# EAGLE design Rev1.1 (EAGLE 9.0.1)
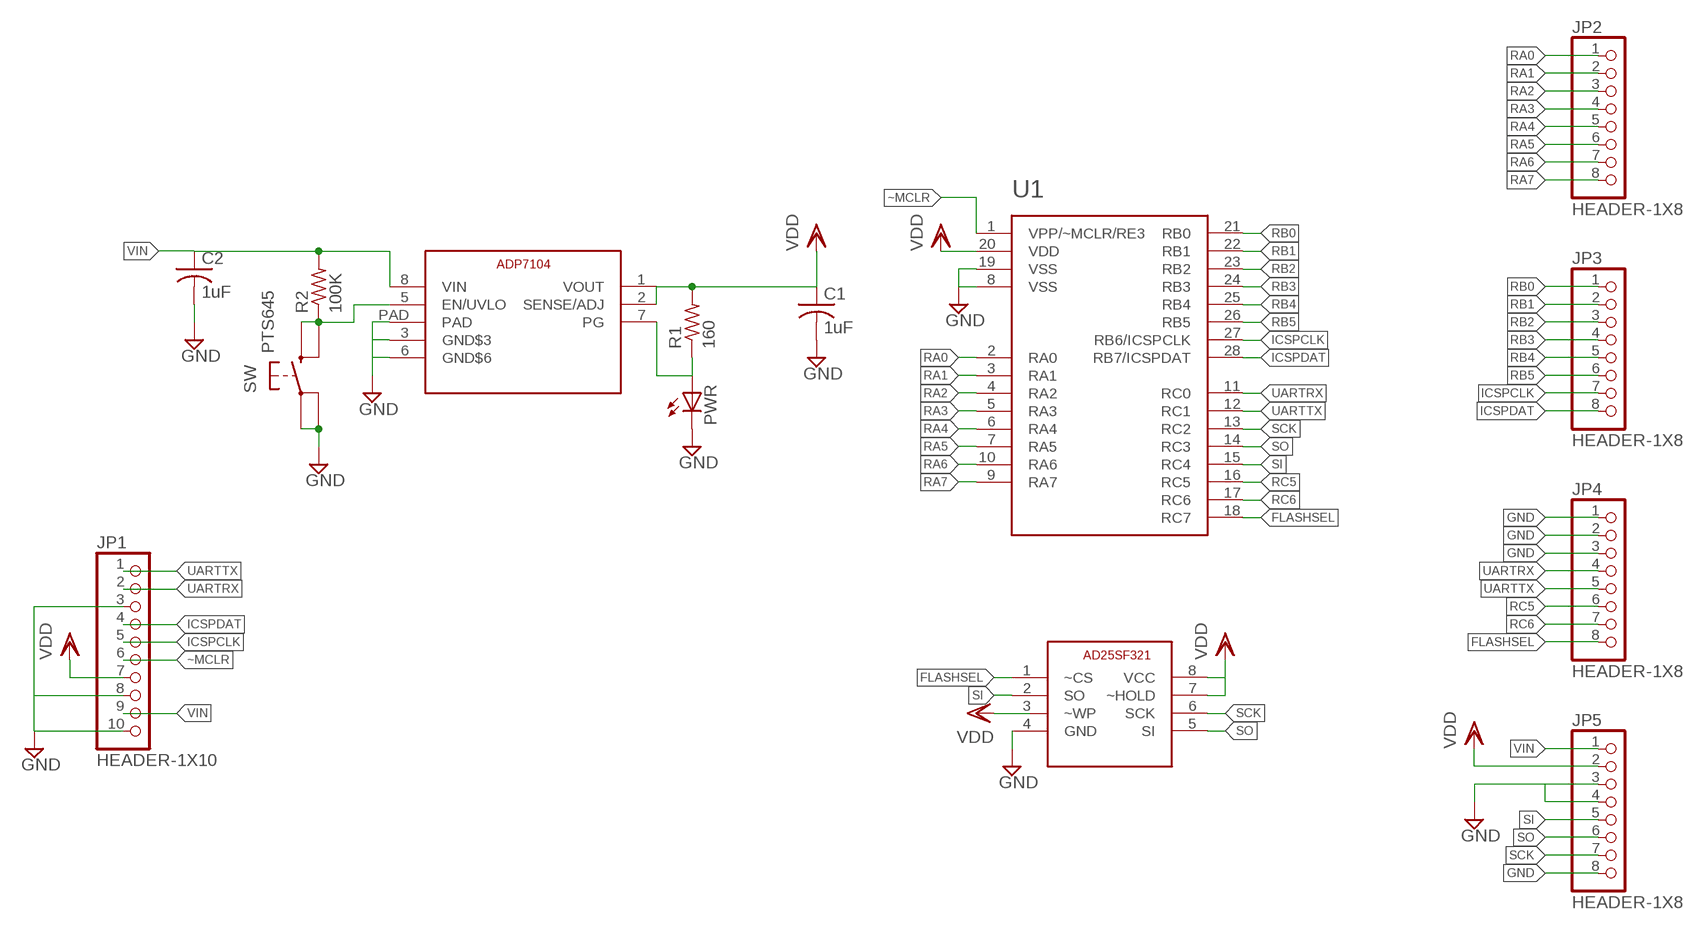
[diagram p0: schematic, sheet 1]

## Parts
C1  1uF  C-USC0805  [C0805]
C2  1uF  C-USC0805  [C0805]
JP1  HEADER-1X10  [1X10]
JP2  HEADER-1X8  [1X08]
JP3  HEADER-1X8  [1X08]
JP4  HEADER-1X8  [1X08]
JP5  HEADER-1X8  [1X08]
PWR  LEDCHIP-LED0805  [CHIP-LED0805]
R1  160  R-US_R0805  [R0805]
R2  100K  R-US_R0805  [R0805]
SW  PTS645  [TSWITCH-6MM]
U1  PIC16F1778  [SO28W]
U2  AT25SF321  [SOIC8]
U3  ADP7104  [SOIC8-EXP-PAD]

## Nets
FLASHSEL: JP4.8 U1.18(RC7) U2.1(~CS)
GND: C1.2 C2.2 JP1.3 JP1.8 JP1.10 JP4.1 JP4.2 JP4.3 JP5.3 JP5.4 JP5.8 PWR.C SW.P$1 SW.P$2 U1.8(VSS) U1.19(VSS) U2.4(GND) U3.3(GND$3) U3.6(GND$6) U3.PAD
ICSPCLK: JP1.5 JP3.7 U1.27(RB6/ICSPCLK)
ICSPDAT: JP1.4 JP3.8 U1.28(RB7/ICSPDAT)
N$11: PWR.A R1.1 U3.7(PG)
N$12: R2.1 SW.P$3 SW.P$4 U3.5(EN/UVLO)
RA0: JP2.1 U1.2(RA0)
RA1: JP2.2 U1.3(RA1)
RA2: JP2.3 U1.4(RA2)
RA3: JP2.4 U1.5(RA3)
RA4: JP2.5 U1.6(RA4)
RA5: JP2.6 U1.7(RA5)
RA6: JP2.7 U1.10(RA6)
RA7: JP2.8 U1.9(RA7)
RB0: JP3.1 U1.21(RB0)
RB1: JP3.2 U1.22(RB1)
RB2: JP3.3 U1.23(RB2)
RB3: JP3.4 U1.24(RB3)
RB4: JP3.5 U1.25(RB4)
RB5: JP3.6 U1.26(RB5)
RC5: JP4.6 U1.16(RC5)
RC6: JP4.7 U1.17(RC6)
SCK: JP5.7 U1.13(RC2) U2.6(SCK)
SI: JP5.5 U1.15(RC4) U2.2(SO)
SO: JP5.6 U1.14(RC3) U2.5(SI)
UARTRX: JP1.2 JP4.4 U1.11(RC0)
UARTTX: JP1.1 JP4.5 U1.12(RC1)
VDD: C1.1 JP1.7 JP5.2 R1.2 U1.20(VDD) U2.7(~HOLD) U2.8(VCC) U3.1(VOUT) U3.2(SENSE/ADJ)
VIN: C2.1 JP1.9 JP5.1 R2.2 U3.8(VIN)
~MCLR: JP1.6 U1.1(VPP/~MCLR/RE3)
Unconnected: U2.3(~WP)

## Library data of the parts
C1 C2 = adafruit:C-US: CAPACITOR, American symbol
JP1 = lib-works:HEADER-1X10
JP2-JP5 = lib-works:HEADER-1X8
PWR = adafruit:LED: LED OSRAM: - CHIPLED LG R971, LG N971, LY N971, LG Q971, LY Q971, LO R971, LY R971 LH N974, LH R974 LS Q976, LO Q976, LY Q976 LO Q996 - Hyper CHIPLED LW Q18S LB Q993, LB Q99A, LB R99A - SideLED LS A670, LO A670, LY A670, LG A670, LP A670 LB A673, LV A673, LT A673, LW A673 LH A674 LY A675 LS A676, LA A676, LO A676, LY A676, LW A676 LS A679, LY A679, LG A679 - Hyper Micro SIDELED® LS Y876, LA Y876, LO Y876, LY Y876 LT Y87S - SmartLED LW L88C, LW L88S LB L89C, LB L89S, LG L890 LS L89K, LO L89K, LY L89K LS L896, LA L896, LO L896, LY L896 - TOPLED LS T670, LO T670, LY T670, LG T670, LP T670 LSG T670, LSP T670, LSY T670, LOP T670, LYG T670 LG T671, LOG T671, LSG T671 LB T673, LV T673, LT T673, LW T673 LH T674 LS T676, LA T676, LO T676, LY T676, LB T676, LH T676, LSB T676, LW T676 LB T67C, LV T67C, LT T67C, LS T67K, LO T67K, LY T67K, LW E67C LS E67B, LA E67B, LO E67B, LY E67B, LB E67C, LV E67C, LT E67C LW T67C LS T679, LY T679, LG T679 LS T770, LO T770, LY T770, LG T770, LP T770 LB T773, LV T773, LT T773, LW T773 LH T774 LS E675, LA E675, LY E675, LS T675 LS T776, LA T776, LO T776, LY T776, LB T776 LHGB T686 LT T68C, LB T68C - Hyper Mini TOPLED® LB M676 - Mini TOPLED Santana® LG M470 LS M47K, LO M47K, LY M47K Source: http://www.osram.convergy.de/
R1 R2 = adafruit:R-US_: RESISTOR, American symbol
SW = lib-works:PTS645
U1 = lib-works:PIC16F1778
U2 = lib-works:AT25SF321
U3 = lib-works:ADP7104

## Board
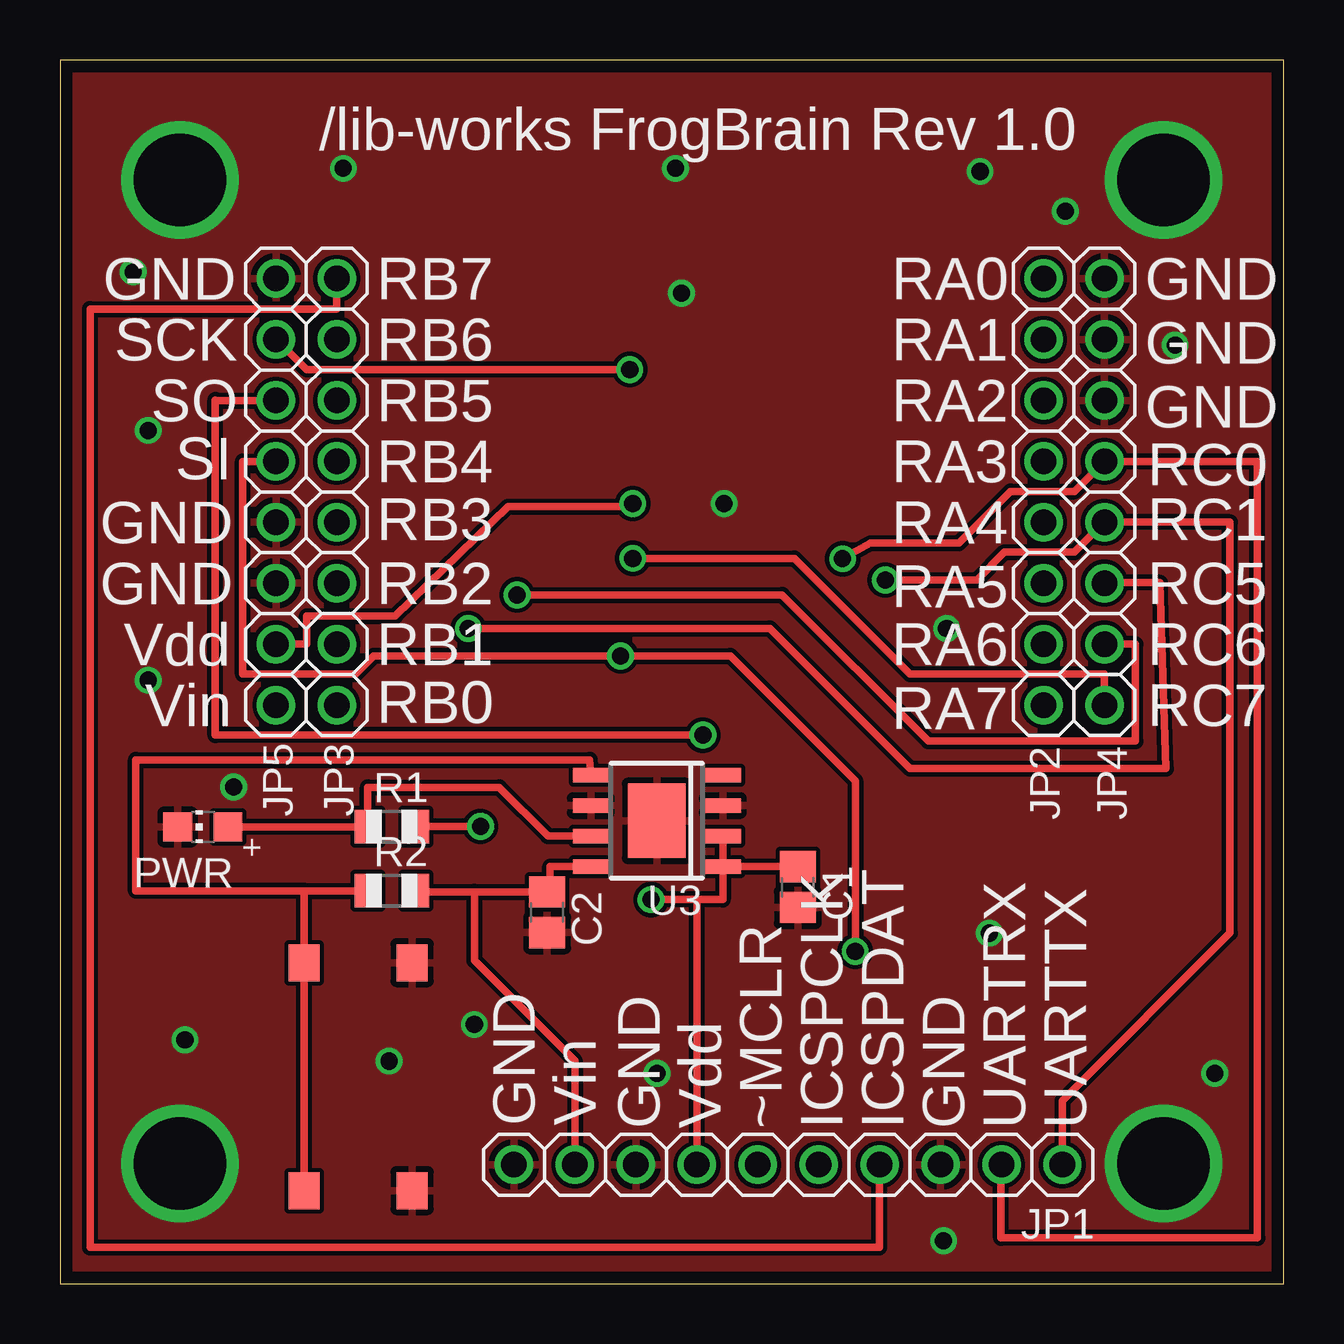
[diagram p1: board, top side]
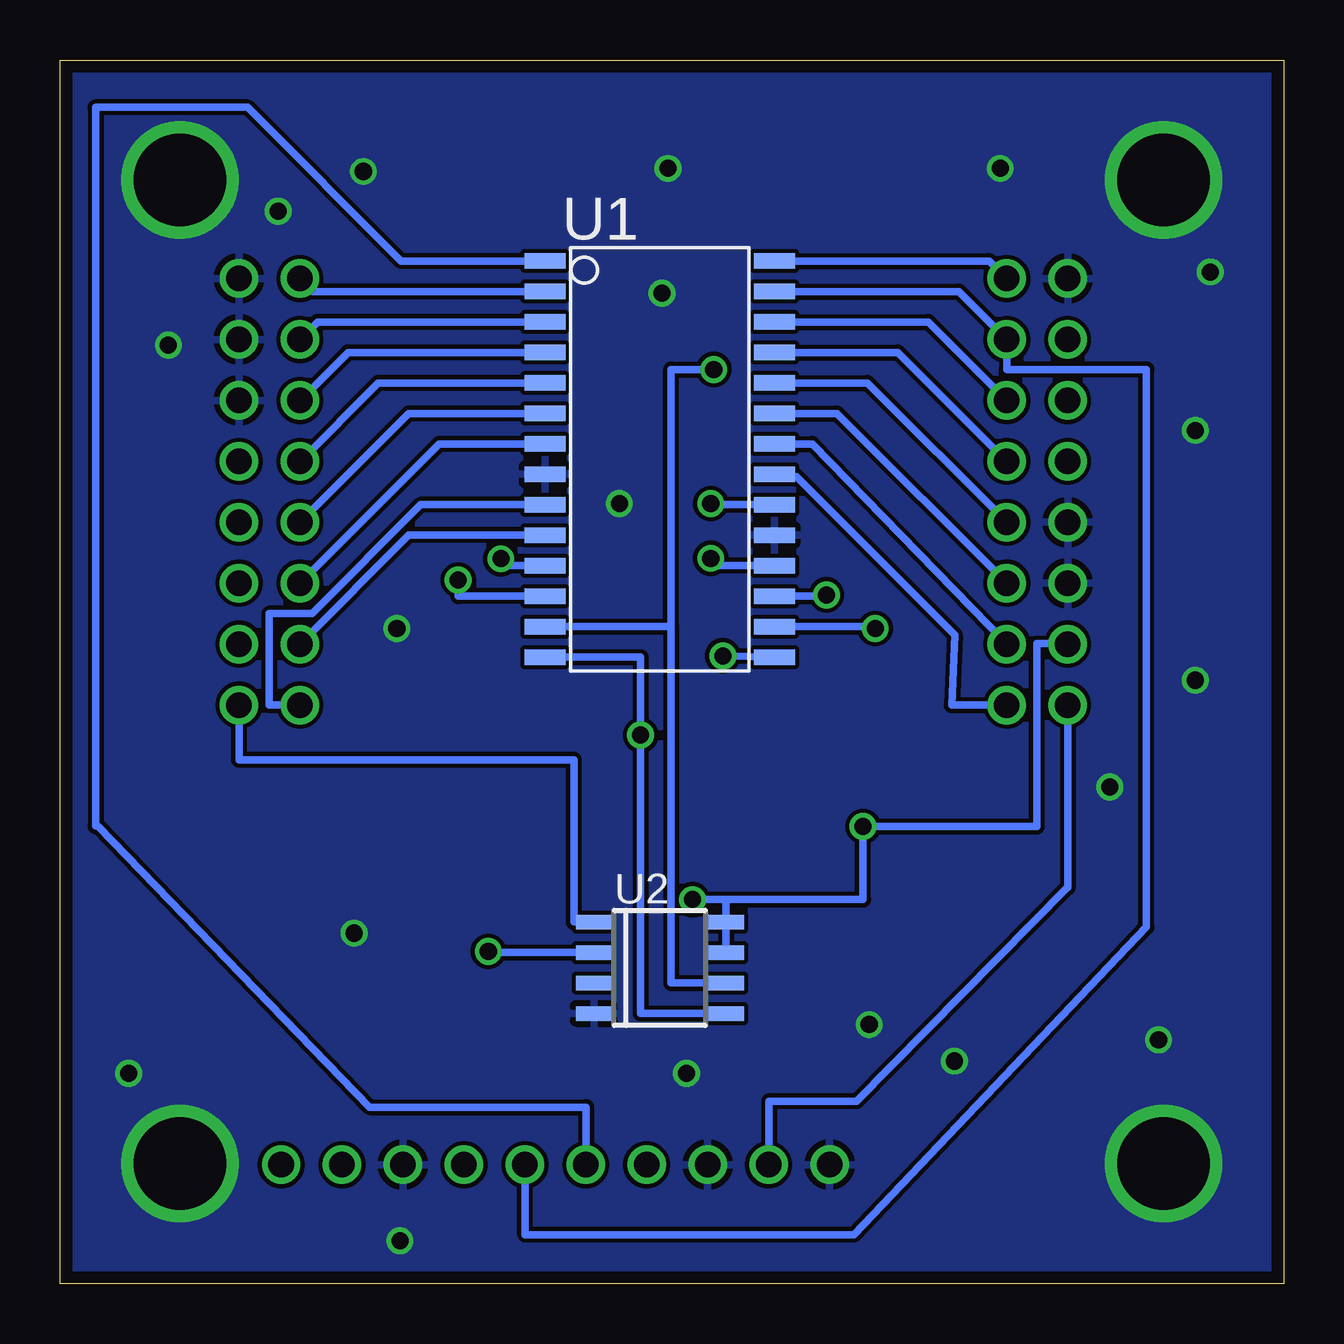
[diagram p2: board, bottom side, seen from below]

Size 51 x 51 mm. Coordinates in mm from the lower left corner, seen from the top.
Outline: 0,0 51,0 51,51 0,51 0,0
Copper layers (1*16): Top 0.035mm / dielectric 1.5mm / Bottom 0.035mm
Design rules "default *": minimum track width 7mil, minimum drill 0.50038125mm, track to track 7mil, track to pad 7mil, pad to pad 7mil, via to via 7mil, smd to smd 7mil, copper to edge 20mil, drill to drill 7mil, minimum pad ring 10mil, minimum via ring 8mil, stop-mask expansion 4mil, vias tented up to drill 0mil, thermal gap 10mil

### Footprints (pad centres in the part's own frame; a part is rotated, then mirrored left to right if it is on the bottom)
C0805 = smd 1.3 x 1.5: 1 -0.85,0; 2 0.85,0
1X10 = drill 1.067: 1 -8.89,0; 2 -6.35,0; 3 -3.81,0; 4 -1.27,0; 5 1.27,0; 6 3.81,0; 7 6.35,0; 8 8.89,0; 9 11.43,0; 10 13.97,0
1X08 = drill 1.067: 1 -8.89,0; 2 -6.35,0; 3 -3.81,0; 4 -1.27,0; 5 1.27,0; 6 3.81,0; 7 6.35,0; 8 8.89,0
CHIP-LED0805 = smd 1.2 x 1.2: A 0,-1.05; C 0,1.05
R0805 = smd 1.1 x 1.4: 1 -1,0; 2 1,0
TSWITCH-6MM = smd 1.55 x 1.3: P$1 -4.75,2.25; P$2 4.75,2.25; P$3 -4.75,-2.25; P$4 4.75,-2.25
SO28W = smd 0.65 x 1.7: 1 -7.62,-4.78; 2 -6.35,-4.78; 3 -5.08,-4.78; 4 -3.81,-4.78; 5 -2.54,-4.78; 6 -1.27,-4.78; 7 0,-4.78; 8 1.27,-4.78; 9 2.54,-4.78; 10 3.81,-4.78; 11 5.08,-4.78; 12 6.35,-4.78; 13 7.62,-4.78; 14 8.89,-4.78; 15 8.89,4.78; 16 7.62,4.78; 17 6.35,4.78; 18 5.08,4.78; 19 3.81,4.78; 20 2.54,4.78; 21 1.27,4.78; 22 0,4.78; 23 -1.27,4.78; 24 -2.54,4.78; 25 -3.81,4.78; 26 -5.08,4.78; 27 -6.35,4.78; 28 -7.62,4.78
SOIC8 = smd 0.6 x 1.5: 1 -1.905,-2.75; 2 -0.635,-2.75; 3 0.635,-2.75; 4 1.905,-2.75; 5 1.905,2.75; 6 0.635,2.75; 7 -0.635,2.75; 8 -1.905,2.75
SOIC8-EXP-PAD = smd 0.6 x 1.5: 1 -1.905,-2.75; 2 -0.635,-2.75; 3 0.635,-2.75; 4 1.905,-2.75; 5 1.905,2.75; 6 0.635,2.75; 7 -0.635,2.75; 8 -1.905,2.75 | smd 3.1 x 2.41: PAD 0,0

### Placement (x,y rotation side)
C1  30.75,16.53 270 top
C2  20.3,15.48 270 top
JP1  32.89,4.95 180 top
JP2  41,33 270 top
JP3  11.54,33 90 top
JP4  43.54,33 270 top
JP5  9,33 90 top
PWR  5.95,19.03 90 top
R1  13.83,19.03 0 top
R2  13.83,16.37 0 top
SW  12.43,8.62 270 top
U1  26,35 270 bottom
U2  26,13.16 270 bottom
U3  24.88,19.29 90 top

### Tracks (layer width: path | path; a pad name or v marks a point on that pad's centre or on a via)
FLASHSEL  (via drill 0.71)
  Top 0.305: v23.88,30.23 30.61,30.23 35.43,25.4 43.54,25.4 JP4.8
  Bottom 0.305: JP4.8 43.54,21.83 29.57,21.83 29.57,15.06 U2.1 | U1.18 24.13,29.92 v23.88,30.23
GND  (via drill 0.71, 3.86)
  other vias: 11.81,46.48 25.65,46.48 38.35,46.35 41.91,44.7 25.91,41.27 3.05,42.16 3.68,35.56 3.68,25.15 7.24,20.7 5.21,10.16 13.72,9.27 17.27,10.79 36.83,1.78 48.13,8.76 38.73,14.61 46.48,39.12 36.96,27.3 27.69,32.51 24.89,8.76 5,46 5,5 46,46 46,5
  pour Top: -1.14,50.42 -1.14,-1.14 51.05,-1.14 51.44,50.67 -1.14,50.67
  pour Bottom: -1.65,50.55 -1.65,-1.4 51.18,-1.4 51.18,50.8
ICSPCLK
  Bottom 0.305: U1.27 13.54,41.35 JP3.7 11.54,38.1 5.71,38.1 5.71,14.86 17.91,2.03 31.61,2.03 31.61,4.94 JP1.5
ICSPDAT
  Top 0.305: JP3.8 11.54,40.62 1.25,40.62 1.25,1.51 34.15,1.51 34.15,4.94 JP1.4
  Bottom 0.305: U1.28 12.27,42.62 JP3.8
N$11
  Top 0.305: PWR.A R1.1 12.83,20.68 18.3,20.68 20.34,18.65 U3.7
N$12
  Top 0.305: SW.P$4 SW.P$3 10.18,16.37 | 10.18,16.37 R2.1 | 10.18,16.37 3.16,16.37 3.16,21.83 22.08,21.83 U3.5
RA0
  Bottom 0.305: U1.2 40.46,41.35 JP2.1
RA1
  Bottom 0.305: U1.3 40.27,40.08 JP2.2
RA2
  Bottom 0.305: U1.4 39,38.81 JP2.3
RA3
  Bottom 0.305: U1.5 37.73,37.54 JP2.4
RA4
  Bottom 0.305: U1.6 36.46,36.27 JP2.5
RA5
  Bottom 0.305: U1.7 35.19,35 JP2.6
RA6
  Bottom 0.305: U1.10 36.46,31.19 JP2.7
RA7
  Bottom 0.305: U1.9 35.96,32.46 40.5,27.92 42.27,27.92 42.27,24.11 JP2.8
RB0
  Bottom 0.305: U1.21 21.13,33.64 20.3,33.64 13.7,27.04 13.83,24.11 13.44,24.11 JP3.1
RB1
  Bottom 0.305: U1.22 19.64,35 JP3.2
RB2
  Bottom 0.305: U1.23 18.62,36.27 JP3.3
RB3
  Bottom 0.305: U1.24 17.35,37.54 JP3.4
RB4
  Bottom 0.305: U1.25 16.08,38.81 JP3.5
RB5
  Bottom 0.305: U1.26 14.81,40.08 JP3.6
RC5  (via drill 0.71)
  Top 0.305: JP4.6 43.55,29.21 45.85,29.21 46.1,21.46 35.43,21.46 29.59,27.3 v17.02,27.3
  Bottom 0.305: U1.16 17.27,27.38 v17.02,27.3
RC6  (via drill 0.71)
  Top 0.305: v19.05,28.7 30.1,28.7 36.2,22.61 44.83,22.61 44.83,26.65 JP4.7
  Bottom 0.305: U1.17 19.3,28.65 v19.05,28.7
SCK  (via drill 0.71)
  Top 0.305: v23.75,38.1 10.29,38.1 9.04,39.35 JP5.7
  Bottom 0.305: U1.13 25.53,27.38 | U2.6 25.53,12.52 25.53,27.38 | 25.53,27.38 25.53,38.1 v23.75,38.1
SI  (via drill 0.71)
  Top 0.305: JP5.5 7.62,34.27 7.62,25.4 12.32,25.4 13.08,26.16 v23.37,26.16 27.94,26.16 33.15,20.95 v33.15,13.84
  Bottom 0.305: v23.37,26.16 21.34,26.11 U1.15 | v33.15,13.84 33.15,13.79 U2.2
SO  (via drill 0.71)
  Top 0.305: v26.8,22.86 6.48,22.86 6.48,36.81 | 6.48,36.83 6.48,36.81 | 6.48,36.81 JP5.6
  Bottom 0.305: U1.14 26.8,26.11 v26.8,22.86 26.8,11.25 U2.5
UARTRX  (via drill 0.71)
  Top 0.305: v32.62,30.21 33.78,30.86 37.47,30.86 39.62,33.02 42.29,33.02 JP4.4 49.91,34.27 49.91,1.91 39.23,1.91 39.23,4.94 JP1.2
  Bottom 0.305: U1.11 32.24,29.92 v32.62,30.21
UARTTX  (via drill 0.71)
  Top 0.305: v34.4,29.32 38.21,29.32 39.37,30.48 42.29,30.48 JP4.5 48.77,31.73 48.77,14.61 41.78,7.62 JP1.1
  Bottom 0.305: U1.12 34.4,28.65 v34.4,29.32
VDD  (via drill 0.71)
  Top 0.305: U3.1 U3.2 | U3.1 C1.1 | U3.1 27.63,16 26.54,16 | 26.54,16 v24.64,16 | v17.53,19.05 14.83,19.05 R1.2 | JP5.2 10.29,26.65 10.29,27.81 13.97,27.81 18.67,32.38 23.75,32.38 v23.88,32.51 | 26.54,16 26.53,15.99 26.54,15.97 JP1.7
  Bottom 0.305: U2.7 U2.8 23.25,16 | v24.64,16 23.25,16 | 23.25,16 17.53,16 v17.53,19.05 10.29,19.05 10.29,26.67 9,26.67 JP5.2 | v23.88,32.51 23.82,32.46 U1.20
VIN
  Top 0.305: 17.27,16.33 14.87,16.33 R2.2 | 17.27,16.33 C2.1 | C2.1 20.43,16.33 20.43,17.38 U3.8 | 20.3,16.37 C2.1 | 17.27,16.33 17.27,13.46 21.46,9.27 JP1.9
  Bottom 0.305: JP5.1 9,16.51 9.02,16.51 17.8,7.6 21.45,7.6 21.45,4.97 JP1.9
~MCLR
  Bottom 0.305: U1.1 36.78,42.62 43.18,49.02 49.51,49.02 49.51,19.07 49.4,19.05 38.08,7.35 29.07,7.35 29.07,4.97 JP1.6

### Text on the board
tPlace: /lib-works FrogBrain Rev 1.0 | GND | GND | RB7 | RA0 | GND | SCK | RB6 | RA1 | GND | SO | RB5 | RA2 | SI | GND | RB4 | RA3 | RC0 | RB3 | RA4 | RC1 | GND | RB2 | RA5 | RC5 | Vdd | RB1 | RA6 | RC6 | Vin | RB0 | RA7 | RC7 | GND | Vin | GND | Vdd | ~MCLR | ICSPCLK | ICSPDAT | GND | UARTRX | UARTTX